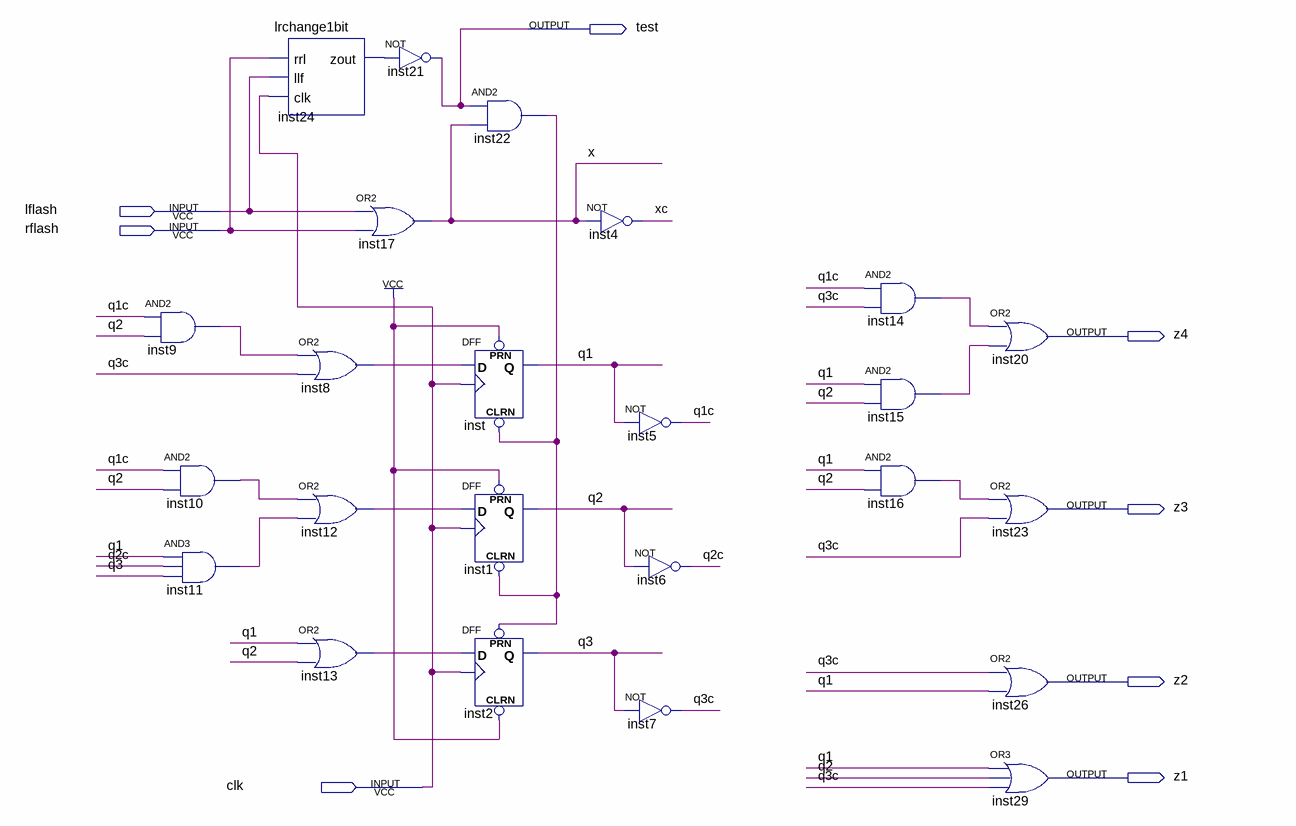
[diagram p0: schematic sheet]
// Quartus schematic flash1.bdf as structural Verilog: 24 symbols, 8 pins
module flash1 (
  input  lflash,
  input  rflash,
  input  clk,
  output test,
  output z4,
  output z3,
  output z2,
  output z1
);

  wire inst8_out, inst9_out, inst10_out, inst11_out, inst12_out, inst13_out, inst14_out, inst15_out,
       inst16_out, inst22_out, inst24_zout, q1, q1c, q2, q2c, q3, q3c, x, xc;

  and inst9 (inst9_out, q1c, q2);
  and inst10 (inst10_out, q1c, q2);
  and inst11 (inst11_out, q1, q2c, q3);
  lrchange1bit inst24 (.rrl(rflash), .llf(lflash), .clk(clk), .zout(inst24_zout));
  or inst17 (x, lflash, rflash);
  or inst8 (inst8_out, inst9_out, q3c);
  or inst12 (inst12_out, inst10_out, inst11_out);
  or inst13 (inst13_out, q1, q2);
  not inst21 (test, inst24_zout);
  and inst22 (inst22_out, test, x);
  DFF inst (.CLRN(inst22_out), .CLK(clk), .D(inst8_out), .PRN(1'b1), .Q(q1));
  DFF inst1 (.CLRN(inst22_out), .CLK(clk), .D(inst12_out), .PRN(1'b1), .Q(q2));
  DFF inst2 (.CLRN(1'b1), .CLK(clk), .D(inst13_out), .PRN(inst22_out), .Q(q3));
  not inst4 (xc, x);
  not inst5 (q1c, q1);
  not inst6 (q2c, q2);
  not inst7 (q3c, q3);
  and inst14 (inst14_out, q1c, q3c);
  and inst15 (inst15_out, q1, q2);
  and inst16 (inst16_out, q1, q2);
  or inst20 (z4, inst14_out, inst15_out);
  or inst23 (z3, inst16_out, q3c);
  or inst26 (z2, q3c, q1);
  or inst29 (z1, q1, q2, q3c);
endmodule
